# Altium schematic sheet 06-General I2C Devices.SchDoc
size B; SheetNumber: 6; SheetTotal: 22
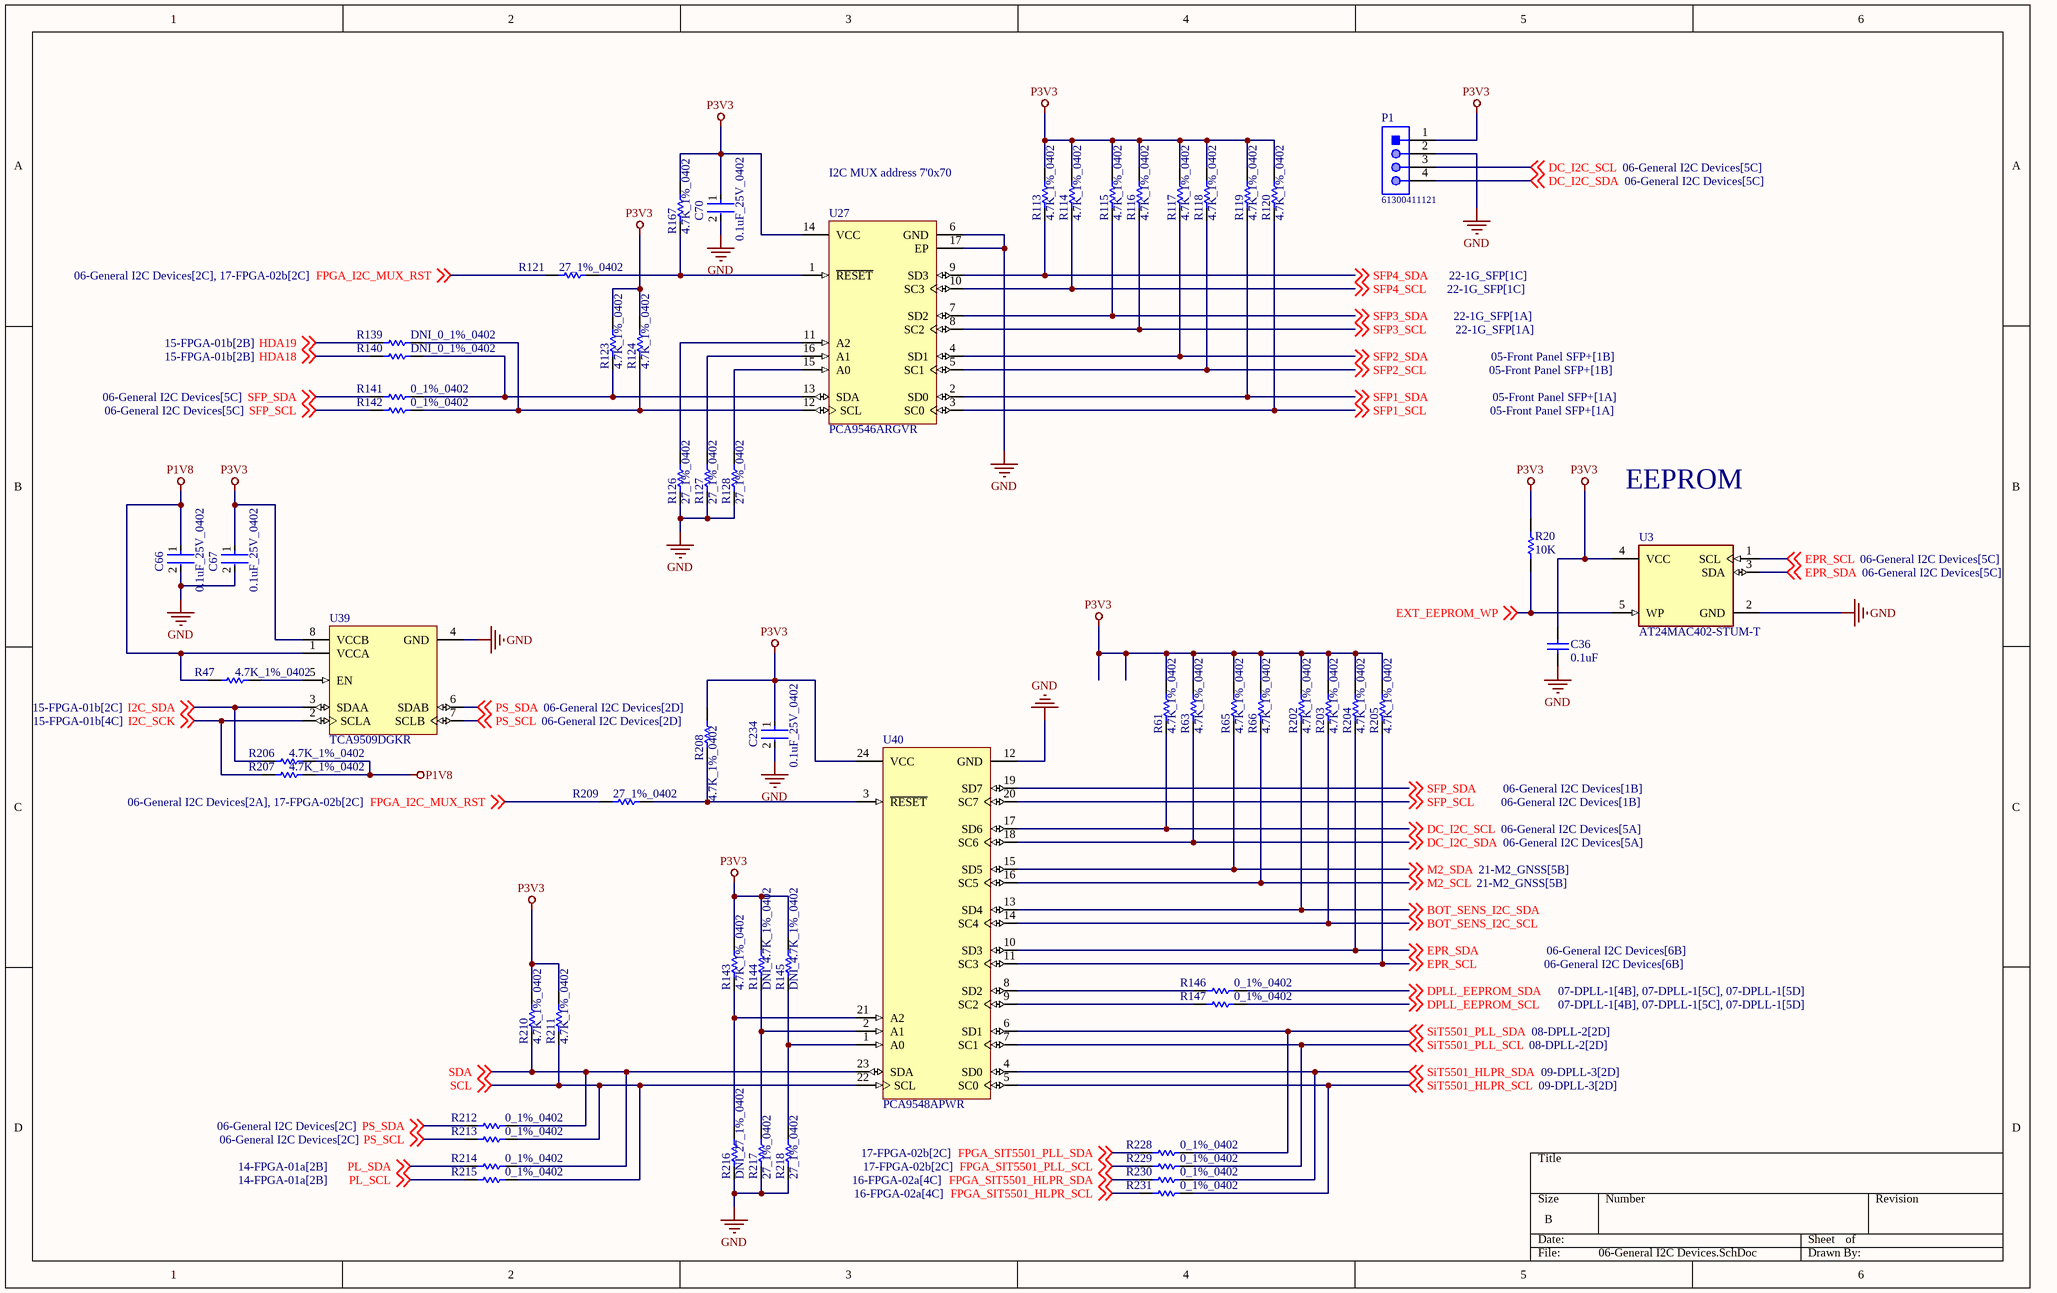
[diagram p0: 06-General I2C Devices.SchDoc]

## Parts
C36  0.1uF  [CAPC1608X87X45ML20T05]
C66  0.1uF_25V_0402  [FP-0402-L_1_0_1-W_0_5_0_1-IPC_C]
C67  0.1uF_25V_0402  [FP-0402-L_1_0_1-W_0_5_0_1-IPC_C]
C70  0.1uF_25V_0402  [FP-0402-L_1_0_1-W_0_5_0_1-IPC_C]
C234  0.1uF_25V_0402  [FP-0402-L_1_0_1-W_0_5_0_1-IPC_C]
P1  61300411121  [61300411121]
R20  10K  [RESC1608X55X30LL15T20]
R47  4.7K_1%_0402  [RESC1005X40X25NL10T10]
R61  4.7K_1%_0402  [RESC1005X40X25NL10T10]
R63  4.7K_1%_0402  [RESC1005X40X25NL10T10]
R65  4.7K_1%_0402  [RESC1005X40X25NL10T10]
R66  4.7K_1%_0402  [RESC1005X40X25NL10T10]
R113  4.7K_1%_0402  [RESC1005X40X25NL10T10]
R114  4.7K_1%_0402  [RESC1005X40X25NL10T10]
R115  4.7K_1%_0402  [RESC1005X40X25NL10T10]
R116  4.7K_1%_0402  [RESC1005X40X25NL10T10]
R117  4.7K_1%_0402  [RESC1005X40X25NL10T10]
R118  4.7K_1%_0402  [RESC1005X40X25NL10T10]
R119  4.7K_1%_0402  [RESC1005X40X25NL10T10]
R120  4.7K_1%_0402  [RESC1005X40X25NL10T10]
R121  27_1%_0402  [RESC1005X40X25NL05T05]
R123  4.7K_1%_0402  [RESC1005X40X25NL10T10]
R124  4.7K_1%_0402  [RESC1005X40X25NL10T10]
R126  27_1%_0402  [RESC1005X40X25NL05T05]
R127  27_1%_0402  [RESC1005X40X25NL05T05]
R128  27_1%_0402  [RESC1005X40X25NL05T05]
R139  DNI_0_1%_0402  [RESC1005X40X25LL05T05]  (no BOM)
R140  DNI_0_1%_0402  [RESC1005X40X25LL05T05]  (no BOM)
R141  0_1%_0402  [RESC1005X40X25LL05T05]
R142  0_1%_0402  [RESC1005X40X25LL05T05]
R143  4.7K_1%_0402  [RESC1005X40X25NL10T10]
R144  DNI_4.7K_1%_0402  [RESC1005X40X25NL10T10]  (no BOM)
R145  DNI_4.7K_1%_0402  [RESC1005X40X25NL10T10]  (no BOM)
R146  0_1%_0402  [RESC1005X40X25LL05T05]
R147  0_1%_0402  [RESC1005X40X25LL05T05]
R167  4.7K_1%_0402  [RESC1005X40X25NL10T10]
R202  4.7K_1%_0402  [RESC1005X40X25NL10T10]
R203  4.7K_1%_0402  [RESC1005X40X25NL10T10]
R204  4.7K_1%_0402  [RESC1005X40X25NL10T10]
R205  4.7K_1%_0402  [RESC1005X40X25NL10T10]
R206  4.7K_1%_0402  [RESC1005X40X25NL10T10]
R207  4.7K_1%_0402  [RESC1005X40X25NL10T10]
R208  4.7K_1%_0402  [RESC1005X40X25NL10T10]
R209  27_1%_0402  [RESC1005X40X25NL05T05]
R210  4.7K_1%_0402  [RESC1005X40X25NL10T10]
R211  4.7K_1%_0402  [RESC1005X40X25NL10T10]
R212  0_1%_0402  [RESC1005X40X25LL05T05]
R213  0_1%_0402  [RESC1005X40X25LL05T05]
R214  0_1%_0402  [RESC1005X40X25LL05T05]
R215  0_1%_0402  [RESC1005X40X25LL05T05]
R216  DNI_27_1%_0402  [RESC1005X40X25NL05T05]  (no BOM)
R217  27_1%_0402  [RESC1005X40X25NL05T05]
R218  27_1%_0402  [RESC1005X40X25NL05T05]
R228  0_1%_0402  [RESC1005X40X25LL05T05]
R229  0_1%_0402  [RESC1005X40X25LL05T05]
R230  0_1%_0402  [RESC1005X40X25LL05T05]
R231  0_1%_0402  [RESC1005X40X25LL05T05]
U3  AT24MAC402-STUM-T  [FP-5TS1-IPC_C]
U27  PCA9546ARGVR  [RGV0016A_V]
U39  TCA9509DGKR  [DGK0008A_L]
U40  PCA9548APWR  [PW0024A_N]

## Nets
GND: C36.1 C66.2 C67.2 C70.2 C234.2 P1.2 R126.1 R127.1 R128.1 R216.1 R217.1 R218.1 U3.2(GND) U27.6(GND) U27.17(EP) U39.4(GND) U40.12(GND)
P1V8: C66.1 R47.2 R206.1 R207.1 U39.1(VCCA)
P3V3: C36.2 C67.1 C70.1 C234.1 P1.1 R20.2 R61.2 R63.2 R65.2 R66.2 R113.2 R114.2 R115.2 R116.2 R117.2 R118.2 R119.2 R120.2 R123.2 R124.2 R143.2 R144.2 R145.2 R167.2 R202.2 R203.2 R204.2 R205.2 R208.2 R210.2 R211.2 U3.4(VCC) U27.14(VCC) U39.8(VCCB) U40.24(VCC)
BOT_SENS_I2C_SCL: R203.1 U40.14(SC4) ; off-sheet BOT_SENS_I2C_SCL
BOT_SENS_I2C_SDA: R202.1 U40.13(SD4) ; off-sheet BOT_SENS_I2C_SDA
DC_I2C_SCL: P1.3 R61.1 U40.17(SD6) ; off-sheet DC_I2C_SCL
DC_I2C_SDA: P1.4 R63.1 U40.18(SC6) ; off-sheet DC_I2C_SDA
DPLL_EEPROM_SCL: R147.2 ; off-sheet DPLL_EEPROM_SCL
DPLL_EEPROM_SDA: R146.2 ; off-sheet DPLL_EEPROM_SDA
EPR_SCL: R205.1 U3.1(SCL) U40.11(SC3) ; off-sheet EPR_SCL
EPR_SDA: R204.1 U3.3(SDA) U40.10(SD3) ; off-sheet EPR_SDA
EXT_EEPROM_WP: R20.1 U3.5(WP) ; off-sheet EXT_EEPROM_WP
FPGA_I2C_MUX_RST: R121.1 R209.1 ; off-sheet FPGA_I2C_MUX_RST
FPGA_SIT5501_HLPR_SCL: R231.1 ; off-sheet FPGA_SIT5501_HLPR_SCL
FPGA_SIT5501_HLPR_SDA: R230.1 ; off-sheet FPGA_SIT5501_HLPR_SDA
FPGA_SIT5501_PLL_SCL: R229.1 ; off-sheet FPGA_SIT5501_PLL_SCL
FPGA_SIT5501_PLL_SDA: R228.1 ; off-sheet FPGA_SIT5501_PLL_SDA
HDA18: R140.1 ; off-sheet HDA18
HDA19: R139.1 ; off-sheet HDA19
I2C_SCK: R207.2 U39.2(SCLA) ; off-sheet I2C_SCK
I2C_SDA: R206.2 U39.3(SDAA) ; off-sheet I2C_SDA
M2_SCL: R66.1 U40.16(SC5) ; off-sheet M2_SCL
M2_SDA: R65.1 U40.15(SD5) ; off-sheet M2_SDA
PL_SCL: R215.1 ; off-sheet PL_SCL
PL_SDA: R214.1 ; off-sheet PL_SDA
PS_SCL: R213.1 U39.7(SCLB) ; off-sheet PS_SCL
PS_SDA: R212.1 U39.6(SDAB) ; off-sheet PS_SDA
SCL: R211.1 R213.2 R215.2 U40.22(SCL) ; off-sheet SCL
SDA: R210.1 R212.2 R214.2 U40.23(SDA) ; off-sheet SDA
SFP1_SCL: R120.1 U27.3(SC0) ; off-sheet SFP1_SCL
SFP1_SDA: R119.1 U27.2(SD0) ; off-sheet SFP1_SDA
SFP2_SCL: R118.1 U27.5(SC1) ; off-sheet SFP2_SCL
SFP2_SDA: R117.1 U27.4(SD1) ; off-sheet SFP2_SDA
SFP3_SCL: R116.1 U27.8(SC2) ; off-sheet SFP3_SCL
SFP3_SDA: R115.1 U27.7(SD2) ; off-sheet SFP3_SDA
SFP4_SCL: R114.1 U27.10(SC3) ; off-sheet SFP4_SCL
SFP4_SDA: R113.1 U27.9(SD3) ; off-sheet SFP4_SDA
SFP_SCL: R142.1 U40.20(SC7) ; off-sheet SFP_SCL
SFP_SDA: R141.1 U40.19(SD7) ; off-sheet SFP_SDA
SiT5501_HLPR_SCL: R231.2 U40.5(SC0) ; off-sheet SiT5501_HLPR_SCL
SiT5501_HLPR_SDA: R230.2 U40.4(SD0) ; off-sheet SiT5501_HLPR_SDA
SiT5501_PLL_SCL: R229.2 U40.7(SC1) ; off-sheet SiT5501_PLL_SCL
SiT5501_PLL_SDA: R228.2 U40.6(SD1) ; off-sheet SiT5501_PLL_SDA
NetR47_1: R47.1 U39.5(EN)
NetR121_2: R121.2 R167.1 U27.1(~{RESET})
NetR123_1: R123.1 R140.2 R141.2 U27.13(SDA)
NetR124_1: R124.1 R139.2 R142.2 U27.12(SCL)
NetR126_2: R126.2 U27.11(A2)
NetR127_2: R127.2 U27.16(A1)
NetR128_2: R128.2 U27.15(A0)
NetR143_1: R143.1 R216.2 U40.21(A2)
NetR144_1: R144.1 R217.2 U40.2(A1)
NetR145_1: R145.1 R218.2 U40.1(A0)
NetR146_1: R146.1 U40.8(SD2)
NetR147_1: R147.1 U40.9(SC2)
NetR208_1: R208.1 R209.2 U40.3(~{RESET})

## Notes on the sheet
- I2C MUX address 7'0x70
- EEPROM

## Library data of the parts
C36 = CMP-2006-00003-1: C0603X104K5RACAUTO; Manufacturer: Kemet; Part Number: C0603X104K5RACAUTO
C66 C67 C70 C234 = CMP-2008-02519-2: General Purpose Ceramic Capacitor, 0402, 100nF, 10%, X7R, 15%, 25V; Package Quantity: 1; Capacitance: 100nF; Min Operating Temperature: -55°C; Voltage: 25V; Voltage Rating: 25V; Construction: Flat; Max Operating Temperature: 125°C; Radiation Hardening: No; Depth: 0.5mm; Thickness: 0.022inch; Voltage Rating (DC): 25V; Number of Pins: 2; Lead Free: Lead Free; Series: -; REACH SVHC: No SVHC; Length: 1mm; Dielectric: X7R; RoHS Compliant: Yes; Mount: Surface Mount; Packaging: Tape and Reel; Case/Package: 0402; Case Code (Imperial): 0402; Termination: SMD/SMT; Width: 0.02inch; Case Code (Metric): 1005; Tolerance: 10%
P1 = CMP-1502-01064-1: THT Vertical Pin Header WR-PHD, Pitch 2.54 mm, Single Row, 4 pins; Manufacturer: Wurth Elektronik; Withstanding Voltage: 500VAC; Rated Current: 3A; Working Voltage: 250VAC; Pin Number: 4; Gender: Male; Contact Resistance: 20mOhm; Pitch: 2.54mm; Manufacturer URL: http://www.we-online.de; Operating Temperature: -40to105degC; Packaging: Bag; Mounting Technology: THT; Package Reference: 61300411121; Datasheet URL: https://katalog.we-online.de/em/datasheet/6130xx11121.pdf; Publisher: WurthElektronik; Part Number: 61300411121; Row Number: Single; Orientation: Vertical
R20 = CMP-2000-06990-1: Chip Resistor, 10 KOhm, +/- 1%, 0.1 W, -55 to 155 degC, 0603 (1608 Metric), RoHS, Tape and Reel RMCF0603FT10K0; Manufacturer: Stackpole-Electronics-Inc.; Temperature Coefficient: ±100ppm/°C; Power (Watts): 0.1W,1/10W; Package / Case: 0603(1608Metric); Datasheet Version: 01/2017; Resistance (Ohms): 10k; Features: AutomotiveAEC-Q200; Packaging: CutTape(CT); Series: RMCF; Height: 0.022"(0.55mm); Tolerance: ±1%; Manufacturer URL: https://www.seielect.com/; Datasheet URL: https://www.seielect.com/Catalog/SEI-RMCF_RMCP.pdf; Supplier Device Package: 0603; Number of Terminations: 2; Family: ChipResistor-SurfaceMount; Package Reference: 0603; Size / Dimension: 0.061"Lx0.031"W(1.55mmx0.80mm); Mounting Technology: SurfaceMount; Package Description: 2-Pin Surface Mount Device, Body 1.55 x 0.8 mm; Operating Temperature: -55°C~155°C; Composition: ThickFilm; Category: Resistors
R47 R61 R63 R65 R66 R113-R120 R123 R124 R143-R145 R167 R202-R208 R210 R211 = CMP-2002-05217-1: Manufacturer: Bourns; Part Number: CR0402-FX-4701GLF
R121 R126-R128 R209 R216-R218 = CMP-2002-08434-1: Part Number: CRCW040227R0FKED; Manufacturer: Vishay Dale
R139-R142 R146 R147 R212-R215 R228-R231 = CMP-2000-07451-1: Chip Resistor, 0 Ohm, 0.1 W, -55 to 155 degC, 0402 (1005 Metric), RoHS, Tape and Reel; Manufacturer: Panasonic; Voltage Rating (DC): 50V; Temperature Coefficient: 600ppm/��C; Max Power Dissipation: 100mW; Resistance: 0mOhm; Tolerance: 5%; Number of Terminations: 2; Mount: SurfaceMount; Height: 0.35mm; Packaging: TapeandReel; Contact Plating: Tin; Manufacturer URL: http://www.panasonic.com/; Composition: ThickFilm; Max Operating Temperature: 155degC; REACH SVHC: NoSVHC; Case/Package: 0402; Package Reference: 402; Depth: 0.5mm; Package Description: 2-Pin Surface Mount Device, Body 1 x 0.5 mm; Datasheet URL: https://industrial.panasonic.com/cdbs/www-data/pdf/RDA0000/AOA0000C301.pdf; RoHSCompliant: True; Case Code (Imperial): 0402; Military Standard: Not; Min Operating Temperature: -55degC; Power Rating: 100mW; Datasheet Version: 03/2015; Length: 1mm; Case Code (Metric): 1005; Termination: SMD/SMT; Mounting Technology: SurfaceMount; Voltage Rating: 50V; Width: 0.02inch; Package Quantity: 1; Lead Free: LeadFree; Radiation Hardening: No
U3 = CMP-06313-000011-1: IC EEPROM 2K I2C 1MHZ SOT23-5; Manufacturer: Microchip; Memory Size: 2Kbits; Min Supply Voltage: 1.7V; Max Supply Voltage: 5.5V; Frequency: 1000kHz; Standoff Height: 0mm; Nominal Supply Current: 0.4-2mA; Access Time: 0.55us; Interface: I2C,2-Wire; Temperature Range Low: -40°C; Height: 1mm; ComponentLink2URL: http://ww1.microchip.com/downloads/en/DeviceDoc/Atmel-8807-SEEPROM-AT24MAC402-602-Datasheet.pdf; Ipc Land Pattern Name: SOT95P280X100-5; Category: IC; Memory Type: EEPROM; Digikey Description: IC EEPROM 2K I2C 1MHZ SOT23-5; Manufacturer Part Number: AT24MAC402-STUM-T; Device Class L1: Integrated Circuits (ICs); Temperature Range High: +85°C; ComponentLink2Description: Datasheet; RoHS: TRUE; Mouser Description: EEPROM Serial-I2C 2K-bit 256 x 8 1.8V/2.5V/3.3V/5V 5-Pin SOT-23 T/R; Octopart: https://octopart.com/at24mac402-stum-t-microchip-77758112; Temperature: -40°C to +85°C; Package: 5TS1; Device Class L3: EEPROM; Automotive: No; Device Class L2: Memory; Lead Free: Yes
U27 = CMP-0314-00065-2: 4-Channel I2C and SMBus Multiplexer with Reset Functions, 2.3 to 5.5 V, -40 to 85 degC, 16-pin VQFN (RGV), Green (RoHS & no Sb/Br); Manufacturer: Texas Instruments; fSCLK(Max)(MHz): 100, 400; I2C Address: 1110 xxx; VCC(Min)(V): 2.3; 5V Tolerant I/O: Yes; Channel Width: 4; VCC(Max)(V): 5.5; tpd max(ns): 0.3, 1; Simultaneously Active Channels: 1 to 4; Max Frequency(kHz): 400; SubFamily: I2C Multiplexer, Switch; Mounting Technology: Surface Mount; ComponentLink2Description: Package Specification; DatasheetVersion: SCPS148E; PackageDescription: 16-Pin Plastic Quad Flat No-Lead, 4 x 4 mm Body, 0.65 mm Pitch, 2.16 x 2.16 mm Exposed Pad; PackageVersion: revF, Jun-2011; ComponentLink1URL: http://www.ti.com/general/docs/lit/getliterature.tsp?genericPartNumber=PCA9546A&fileType=pdf; Eco-Plan: Green (RoHS & no Sb/Br); Reset Input: Yes; Vcc range(V): 2.3 to 5.5; ComponentLink2URL: http://www.ti.com/litv/pdf/mpds178g; Open Drain I/O Type: Yes; PackageReference: RGV0016A; PartNumber: PCA9546ARGVR; ComponentLink1Description: Datasheet
U39 = CMP-0314-00313-2: Level Translating I2C Bus Repeater, 2.7 to 5.5 V, -40 to 85 degC, 8-pin MSOP (DGK), Green (RoHS & no Sb/Br); Manufacturer: Texas Instruments; Slave Side I2C Bus Capacitance Supported(pF): 400; Open Drain I/O Type: Yes; SubFamily: I2C Hub, Buffer, Repeater; VCC(Max)(V): 5.5; VCC(Min)(V): 2.7; fSCLK(Max)(MHz): 0.4; ComponentLink2URL: http://www.ti.com/litv/pdf/msoi002j; PartNumber: TCA9509DGKR; ComponentLink1URL: http://www.ti.com/general/docs/lit/getliterature.tsp?genericPartNumber=TCA9509&fileType=pdf; Code_JEDEC: MO-187-AA; ComponentLink2Description: Package Specification; DatasheetVersion: SCPS225B; PackageVersion: revE, May-2006; Eco-Plan: Green (RoHS & no Sb/Br); Max Frequency(kHz): 400; ComponentLink1Description: Datasheet; Vcc range(V): 2.7 to 5.5; Mounting Technology: Surface Mount; PackageDescription: 8-Pin Thin Small Outline Package 3 x 3 mm Body ,0.65 mm Pitch; PackageReference: DGK0008A; Enable Pin: Yes; Master Side I2C Bus Capacitance Supported(pF): 400
U40 = CMP-0314-00341-2: 8-Channel I2C Switch with Reset, 2.3 to 5.5 V, -40 to 85 degC, 24-pin TSSOP (PW), Green (RoHS & no Sb/Br); Manufacturer: Texas Instruments; Reset Input: Yes; I2C Address: 1110 xxx; VCC(Max)(V): 5.5; Channel Width: 8; fSCLK(Max)(MHz): 100, 400; SubFamily: I2C Multiplexer, Switch; VCC(Min)(V): 2.3; Simultaneously Active Channels: 1 to 8; Max Frequency(kHz): 400; Technology Family: PCA; ComponentLink2Description: Package Specification; DatasheetVersion: SCPS143C; Code_JEDEC: MO-153; Eco-Plan: Green (RoHS & no Sb/Br); PartNumber: PCA9548APWR; PackageReference: PW0024A; PackageDescription: 24-Pin Thin Small Outline Package 0.65 mm Pitch; Vcc range(V): 2.3 to 5.5; ComponentLink1Description: Datasheet; ComponentLink1URL: http://www.ti.com/general/docs/lit/getliterature.tsp?genericPartNumber=PCA9548A&fileType=pdf; Open Drain I/O Type: Yes; 5V Tolerant I/O: Yes; PackageVersion: revG, Feb-2011; Mounting Technology: Surface Mount; ComponentLink2URL: http://www.ti.com/litv/pdf/mpds177g